# EAGLE design schematic (EAGLE 9.5.2)
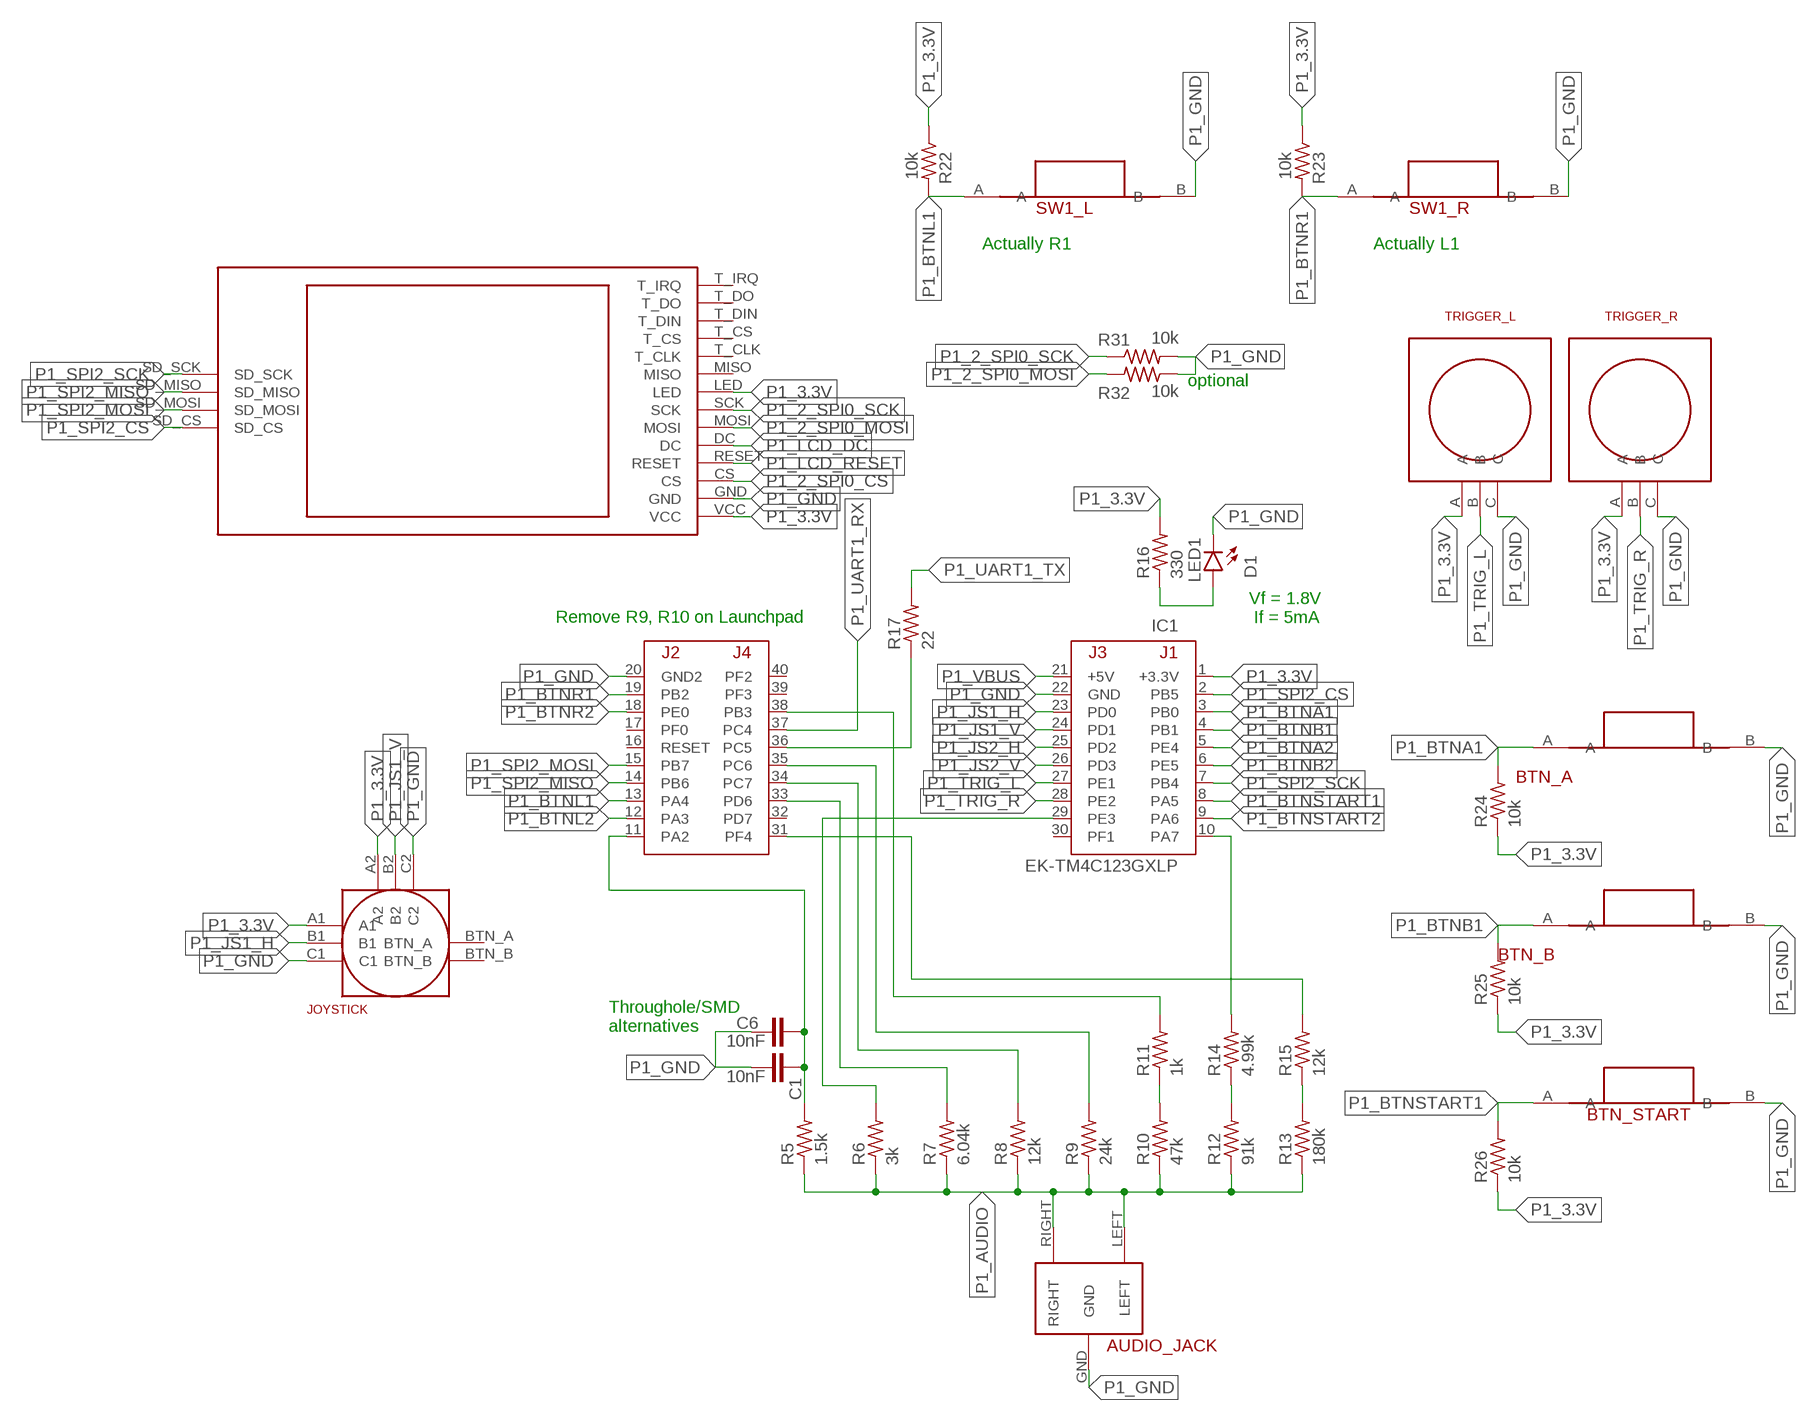
[diagram p0: schematic, sheet 1, part 1 of 2]
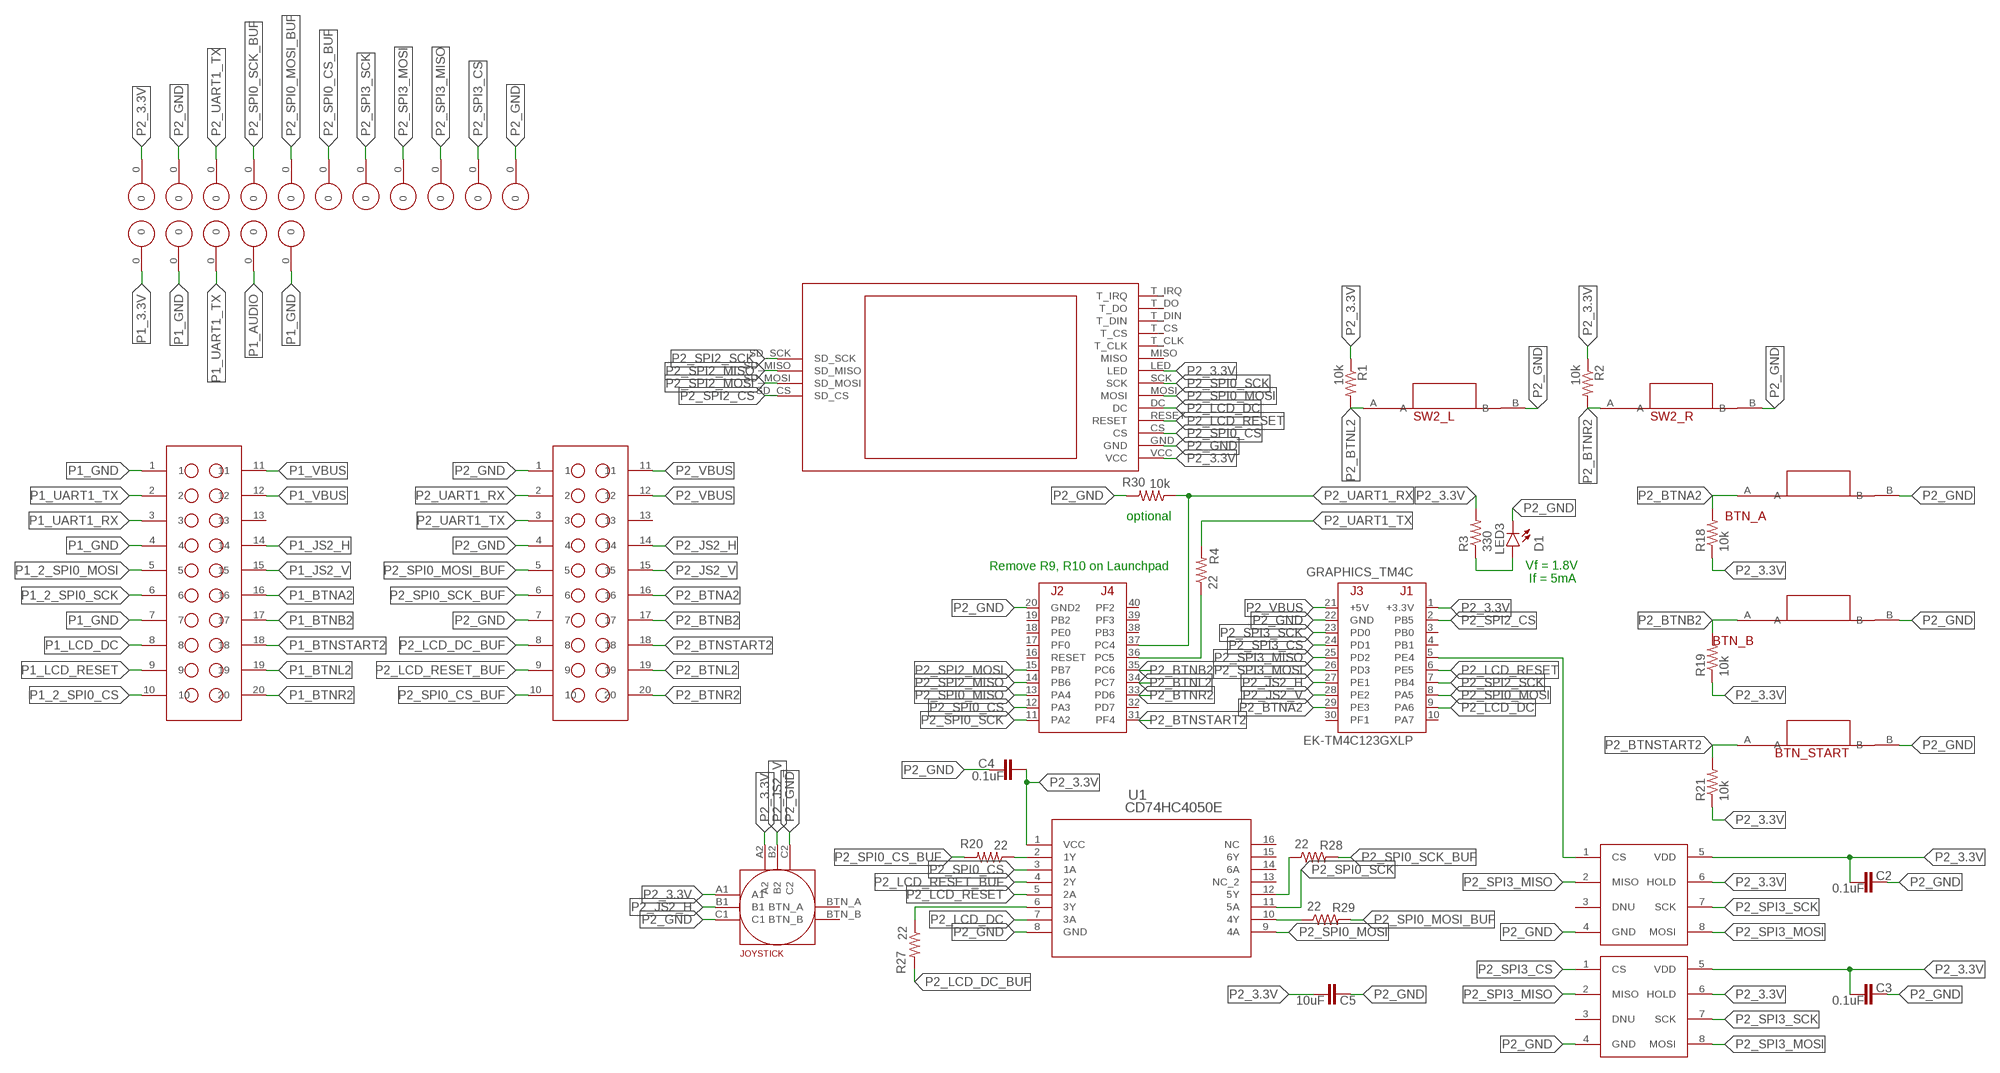
[diagram p1: schematic, sheet 1, part 2 of 2]

## Parts
C1  10nF  C-EU050-024X044  [C050-024X044]
C2  0.1uF  C-EUC0805  [C0805]
C3  0.1uF  C-EUC0805  [C0805]
C4  0.1uF  C-EUC0805  [C0805]
C5  10uF  C-EUC0805  [C0805]
C6  10nF  C-EUC0805  [C0805]
GRAPHICS_TM4C  EK-TM4C123GXLP  [TM4C123LAUNCHPAD]
IC1  EK-TM4C123GXLP  [TM4C123LAUNCHPAD]
LED1  D1  LEDCHIPLED_1206  [CHIPLED_1206]
LED3  D1  LEDCHIPLED_1206  [CHIPLED_1206]
P1_3.3V  3.3v  TESTPOINT  [TESTPOINT]
P1_AUDIO  TESTPOINT  [TESTPOINT]
P1_GND  TESTPOINT  [TESTPOINT]
P1_GND1  TESTPOINT  [TESTPOINT]
P1_LCD  ILI9341  [ILI9341]
P1_UART  TESTPOINT  [TESTPOINT]
P2_3.3V  TESTPOINT  [TESTPOINT]
P2_GND  TESTPOINT  [TESTPOINT]
P2_GND1  TESTPOINT  [TESTPOINT]
P2_LCD  ILI9341  [ILI9341]
P2_SPI0_CS_BUF  TESTPOINT  [TESTPOINT]
P2_SPI0_MOSI_BUF  TESTPOINT  [TESTPOINT]
P2_SPI0_SCK_BUF  TESTPOINT  [TESTPOINT]
P2_SPI3_CS  TESTPOINT  [TESTPOINT]
P2_SPI3_MISO  TESTPOINT  [TESTPOINT]
P2_SPI3_MOSI  TESTPOINT  [TESTPOINT]
P2_SPI3_SCK_BUF  TESTPOINT  [TESTPOINT]
P2_UART1_TX  TESTPOINT  [TESTPOINT]
R1  10k  R-US_R0805  [R0805]
R2  10k  R-US_R0805  [R0805]
R3  330  R-US_R0805  [R0805]
R4  22  R-US_R0805  [R0805]
R5  1.5k  R-US_R0805  [R0805]
R6  3k  R-US_R0805  [R0805]
R7  6.04k  R-US_R0805  [R0805]
R8  12k  R-US_R0805  [R0805]
R9  24k  R-US_R0805  [R0805]
R10  47k  R-US_R0805  [R0805]
R11  1k  R-US_R0805  [R0805]
R12  91k  R-US_R0805  [R0805]
R13  180k  R-US_R0805  [R0805]
R14  4.99k  R-US_R0805  [R0805]
R15  12k  R-US_R0805  [R0805]
R16  330  R-US_R0805  [R0805]
R17  22  R-US_R0805  [R0805]
R18  10k  R-US_R0805  [R0805]
R19  10k  R-US_R0805  [R0805]
R20  22  R-US_R0805  [R0805]
R21  10k  R-US_R0805  [R0805]
R22  10k  R-US_R0805  [R0805]
R23  10k  R-US_R0805  [R0805]
R24  10k  R-US_R0805  [R0805]
R25  10k  R-US_R0805  [R0805]
R26  10k  R-US_R0805  [R0805]
R27  22  R-US_R0805  [R0805]
R28  22  R-US_R0805  [R0805]
R29  22  R-US_R0805  [R0805]
R30  10k  R-US_R0805  [R0805]
R31  10k  R-US_R0805  [R0805]
R32  10k  R-US_R0805  [R0805]
U1  CD74HC4050E  [N16]
U$2  JOYSTICK  [JOYSTICK]
U$3  SW2_R  SW-1825968-2  [SW-1825968-2]
U$4  SW2_L  SW-1825968-2  [SW-1825968-2]
U$5  TRIGGER_L  [TRIGGER_L]
U$6  TRIGGER_R  [TRIGGER_R]
U$7  IS62WVS5128FALL-16NLI  [SOIC127P600X144-8]
U$8  IS62WVS5128FALL-16NLI  [SOIC127P600X144-8]
U$10  AUDIO_JACK  [AUDIO_JACK]
U$11  10X2_HEADER  [10X2_HEADER]
U$12  10X2_HEADER  [10X2_HEADER]
U$13  JOYSTICK  [JOYSTICK]
U$14  BTN_A  BUTTON  [BUTTON]
U$15  BTN_B  BUTTON  [BUTTON]
U$17  BTN_START  BUTTON  [BUTTON]
U$18  SW1_R  SW-1825968-2  [SW-1825968-2]
U$19  SW1_L  SW-1825968-2  [SW-1825968-2]
U$20  BTN_A  BUTTON  [BUTTON]
U$23  BTN_B  BUTTON  [BUTTON]
U$24  BTN_START  BUTTON  [BUTTON]

## Nets
N$1: IC1.29(PE3) R6.2
N$2: C1.1 C6.1 IC1.11(PA2) R5.2
N$3: GRAPHICS_TM4C.5(PE4) U$8.1(CS)
N$4: LED3.A R3.1
N$5: IC1.31(PF4) R15.2
N$8: R10.2 R11.1
N$9: R20.1 U1.2(1Y)
N$10: IC1.33(PD6) R7.2
N$11: R12.2 R14.1
N$12: LED1.A R16.1
N$13: IC1.34(PC7) R8.2
N$14: IC1.35(PC6) R9.2
N$16: IC1.36(PC5) R17.1
N$17: R13.2 R15.1
N$18: R27.1 U1.6(3Y)
N$19: IC1.38(PB3) R11.2
N$20: IC1.10(PA7) R14.2
N$21: R28.1 U1.12(5Y)
N$22: R29.1 U1.10(4Y)
N$91: GRAPHICS_TM4C.36(PC5) R4.1
P1_2_SPI0_CS: P1_LCD.CS U$11.10
P1_2_SPI0_MOSI: P1_LCD.MOSI R32.2 U$11.5
P1_2_SPI0_SCK: P1_LCD.SCK R31.1 U$11.6
P1_3.3V: IC1.1(+3.3V) P1_3.3V.0 P1_LCD.LED P1_LCD.VCC R16.2 R22.1 R23.1 R24.1 R25.1 R26.1 U$2.A1 U$2.A2 U$5.A U$6.A
P1_AUDIO: P1_AUDIO.0 R5.1 R6.1 R7.1 R8.1 R9.1 R10.1 R12.1 R13.1 U$10.LEFT U$10.RIGHT
P1_BTNA1: IC1.3(PB0) R24.2 U$20.A
P1_BTNA2: IC1.5(PE4) U$11.16
P1_BTNB1: IC1.4(PB1) R25.2 U$23.A
P1_BTNB2: IC1.6(PE5) U$11.17
P1_BTNL1: IC1.13(PA4) R22.2 U$19.A
P1_BTNL2: IC1.12(PA3) U$11.19
P1_BTNR1: IC1.19(PB2) R23.2 U$18.A
P1_BTNR2: IC1.18(PE0) U$11.20
P1_BTNSTART1: IC1.8(PA5) R26.2 U$24.A
P1_BTNSTART2: IC1.9(PA6) U$11.18
P1_GND: C1.2 C6.2 IC1.20(GND2) IC1.22(GND) LED1.C P1_GND1.0 P1_GND.0 P1_LCD.GND R31.2 R32.1 U$2.C1 U$2.C2 U$5.C U$6.C U$10.GND U$11.1 U$11.4 U$11.7 U$18.B U$19.B U$20.B U$23.B U$24.B
P1_JS1_H: IC1.23(PD0) U$2.B1
P1_JS1_V: IC1.24(PD1) U$2.B2
P1_JS2_H: IC1.25(PD2) U$11.14
P1_JS2_V: IC1.26(PD3) U$11.15
P1_LCD_DC: P1_LCD.DC U$11.8
P1_LCD_RESET: P1_LCD.RESET U$11.9
P1_SPI2_CS: IC1.2(PB5) P1_LCD.SD_CS
P1_SPI2_MISO: IC1.14(PB6) P1_LCD.SD_MISO
P1_SPI2_MOSI: IC1.15(PB7) P1_LCD.SD_MOSI
P1_SPI2_SCK: IC1.7(PB4) P1_LCD.SD_SCK
P1_TRIG_L: IC1.27(PE1) U$5.B
P1_TRIG_R: IC1.28(PE2) U$6.B
P1_UART1_RX: IC1.37(PC4) U$11.3
P1_UART1_TX: P1_UART.0 R17.2 U$11.2
P1_VBUS: IC1.21(+5V) U$11.11 U$11.12
P2_3.3V: C2.2 C3.2 C4.1 C5.2 GRAPHICS_TM4C.1(+3.3V) P2_3.3V.0 P2_LCD.LED P2_LCD.VCC R1.1 R2.1 R3.2 R18.1 R19.1 R21.1 U1.1(VCC) U$7.5(VDD) U$7.6(HOLD) U$8.5(VDD) U$8.6(HOLD) U$13.A1 U$13.A2
P2_BTNA2: GRAPHICS_TM4C.29(PE3) R18.2 U$12.16 U$14.A
P2_BTNB2: GRAPHICS_TM4C.35(PC6) R19.2 U$12.17 U$15.A
P2_BTNL2: GRAPHICS_TM4C.34(PC7) R1.2 U$4.A U$12.19
P2_BTNR2: GRAPHICS_TM4C.33(PD6) R2.2 U$3.A U$12.20
P2_BTNSTART2: GRAPHICS_TM4C.31(PF4) R21.2 U$12.18 U$17.A
P2_GND: C2.1 C3.1 C4.2 C5.1 GRAPHICS_TM4C.20(GND2) GRAPHICS_TM4C.22(GND) LED3.C P2_GND1.0 P2_GND.0 P2_LCD.GND R30.2 U1.8(GND) U$3.B U$4.B U$7.4(GND) U$8.4(GND) U$12.1 U$12.4 U$12.7 U$13.C1 U$13.C2 U$14.B U$15.B U$17.B
P2_JS2_H: GRAPHICS_TM4C.27(PE1) U$12.14 U$13.B1
P2_JS2_V: GRAPHICS_TM4C.28(PE2) U$12.15 U$13.B2
P2_LCD_DC: GRAPHICS_TM4C.9(PA6) P2_LCD.DC U1.7(3A)
P2_LCD_DC_BUF: R27.2 U$12.8
P2_LCD_RESET: GRAPHICS_TM4C.6(PE5) P2_LCD.RESET U1.5(2A)
P2_LCD_RESET_BUF: U1.4(2Y) U$12.9
P2_SPI0_CS: GRAPHICS_TM4C.12(PA3) P2_LCD.CS U1.3(1A)
P2_SPI0_CS_BUF: P2_SPI0_CS_BUF.0 R20.2 U$12.10
P2_SPI0_MISO: GRAPHICS_TM4C.13(PA4)
P2_SPI0_MOSI: GRAPHICS_TM4C.8(PA5) P2_LCD.MOSI U1.9(4A)
P2_SPI0_MOSI_BUF: P2_SPI0_MOSI_BUF.0 R29.2 U$12.5
P2_SPI0_SCK: GRAPHICS_TM4C.11(PA2) P2_LCD.SCK U1.11(5A)
P2_SPI0_SCK_BUF: P2_SPI0_SCK_BUF.0 R28.2 U$12.6
P2_SPI2_CS: GRAPHICS_TM4C.2(PB5) P2_LCD.SD_CS
P2_SPI2_MISO: GRAPHICS_TM4C.14(PB6) P2_LCD.SD_MISO
P2_SPI2_MOSI: GRAPHICS_TM4C.15(PB7) P2_LCD.SD_MOSI
P2_SPI2_SCK: GRAPHICS_TM4C.7(PB4) P2_LCD.SD_SCK
P2_SPI3_CS: GRAPHICS_TM4C.24(PD1) P2_SPI3_CS.0 U$7.1(CS)
P2_SPI3_MISO: GRAPHICS_TM4C.25(PD2) P2_SPI3_MISO.0 U$7.2(MISO) U$8.2(MISO)
P2_SPI3_MOSI: GRAPHICS_TM4C.26(PD3) P2_SPI3_MOSI.0 U$7.8(MOSI) U$8.8(MOSI)
P2_SPI3_SCK: GRAPHICS_TM4C.23(PD0) P2_SPI3_SCK_BUF.0 U$7.7(SCK) U$8.7(SCK)
P2_UART1_RX: GRAPHICS_TM4C.37(PC4) R30.1 U$12.2
P2_UART1_TX: P2_UART1_TX.0 R4.2 U$12.3
P2_VBUS: GRAPHICS_TM4C.21(+5V) U$12.11 U$12.12
Unconnected: GRAPHICS_TM4C.3(PB0) GRAPHICS_TM4C.4(PB1) GRAPHICS_TM4C.10(PA7) GRAPHICS_TM4C.16(RESET) GRAPHICS_TM4C.17(PF0) GRAPHICS_TM4C.18(PE0) GRAPHICS_TM4C.19(PB2) GRAPHICS_TM4C.30(PF1) GRAPHICS_TM4C.32(PD7) GRAPHICS_TM4C.38(PB3) GRAPHICS_TM4C.39(PF3) GRAPHICS_TM4C.40(PF2) IC1.16(RESET) IC1.17(PF0) IC1.30(PF1) IC1.32(PD7) IC1.39(PF3) IC1.40(PF2) P1_LCD.MISO P1_LCD.T_CLK P1_LCD.T_CS P1_LCD.T_DIN P1_LCD.T_DO P1_LCD.T_IRQ P2_LCD.MISO P2_LCD.T_CLK P2_LCD.T_CS P2_LCD.T_DIN P2_LCD.T_DO P2_LCD.T_IRQ U1.13(NC_2) U1.14(6A) U1.15(6Y) U1.16(NC) U$2.BTN_A U$2.BTN_B U$7.3(DNU) U$8.3(DNU) U$11.13 U$12.13 U$13.BTN_A U$13.BTN_B

## Notes on the sheet
- Actually R1 | Actually L1
- optional
- optional
- Remove R9, R10 on Launchpad
- Vf = 1.8V
   If = 5mA
- Remove R9, R10 on Launchpad
- Vf = 1.8V
   If = 5mA
- Throughole/SMD
  alternatives

## Library data of the parts
C1-C6 = rcl:C-EU: CAPACITOR, European symbol; SPICEPREFIX: C
GRAPHICS_TM4C IC1 = EK-TM4C123GXL:EK-TM4C123GXL: Texas Instruments TM4C123 LaunchPad EK-TM4C123GXL www.ti.com/tool/ek-tm4c123gxl; AVAILABILITY: Unavailable; DESCRIPTION: TM4C123G LaunchPad™ Tiva™ C ARM® Cortex®-M4F MCU 32-Bit Embedded Evaluation Board; MF: Texas Instruments; MP: EK-TM4C123GXL; PACKAGE: None; PRICE: None
LED1 LED3 = led:LED: LED OSRAM: - CHIPLED LG R971, LG N971, LY N971, LG Q971, LY Q971, LO R971, LY R971 LH N974, LH R974 LS Q976, LO Q976, LY Q976 LO Q996 - Hyper CHIPLED LW Q18S LB Q993, LB Q99A, LB R99A - SideLED LS A670, LO A670, LY A670, LG A670, LP A670 LB A673, LV A673, LT A673, LW A673 LH A674 LY A675 LS A676, LA A676, LO A676, LY A676, LW A676 LS A679, LY A679, LG A679 - Hyper Micro SIDELED® LS Y876, LA Y876, LO Y876, LY Y876 LT Y87S - SmartLED LW L88C, LW L88S LB L89C, LB L89S, LG L890 LS L89K, LO L89K, LY L89K LS L896, LA L896, LO L896, LY L896 - TOPLED LS T670, LO T670, LY T670, LG T670, LP T670 LSG T670, LSP T670, LSY T670, LOP T670, LYG T670 LG T671, LOG T671, LSG T671 LB T673, LV T673, LT T673, LW T673 LH T674 LS T676, LA T676, LO T676, LY T676, LB T676, LH T676, LSB T676, LW T676 LB T67C, LV T67C, LT T67C, LS T67K, LO T67K, LY T67K, LW E67C LS E67B, LA E67B, LO E67B, LY E67B, LB E67C, LV E67C, LT E67C LW T67C LS T679, LY T679, LG T679 LS T770, LO T770, LY T770, LG T770, LP T770 LB T773, LV T773, LT T773, LW T773 LH T774 LS E675, LA E675, LY E675, LS T675 LS T776, LA T776, LO T776, LY T776, LB T776 LHGB T686 LT T68C, LB T68C - Hyper Mini TOPLED® LB M676 - Mini TOPLED Santana® LG M470 LS M47K, LO M47K, LY M47K Source: http://www.osram.convergy.de LUXEON: - LUMILED® LXK2-PW12-R00, LXK2-PW12-S00, LXK2-PW14-U00, LXK2-PW14-V00 LXK2-PM12-R00, LXK2-PM12-S00, LXK2-PM14-U00 LXK2-PE12-Q00, LXK2-PE12-R00, LXK2-PE12-S00, LXK2-PE14-T00, LXK2-PE14-U00 LXK2-PB12-K00, LXK2-PB12-L00, LXK2-PB12-M00, LXK2-PB14-N00, LXK2-PB14-P00, LXK2-PB14-Q00 LXK2-PR12-L00, LXK2-PR12-M00, LXK2-PR14-Q00, LXK2-PR14-R00 LXK2-PD12-Q00, LXK2-PD12-R00, LXK2-PD12-S00 LXK2-PH12-R00, LXK2-PH12-S00 LXK2-PL12-P00, LXK2-PL12-Q00, LXK2-PL12-R00 Source: www.luxeon.com KINGBRIGHT: KA-3528ASYC Source: www.kingbright.com
P1_3.3V P1_AUDIO P1_GND P1_GND1 P1_UART P2_3.3V P2_GND P2_GND1 P2_SPI0_CS_BUF P2_SPI0_MOSI_BUF P2_SPI0_SCK_BUF P2_SPI3_CS P2_SPI3_MISO P2_SPI3_MOSI P2_SPI3_SCK_BUF P2_UART1_TX = 319H Final Project:TESTPOINT
P1_LCD P2_LCD = 319H Final Project:ILI9341
R1-R32 = rcl:R-US_: RESISTOR, American symbol; SPICEPREFIX: R
U1 = 319H Final Project:CD74HC4050E; BUILT_BY: EMA_UL_Team; MANUFACTURER_PART_NUMBER: CD74HC4050E; VENDOR: Texas Instruments
U$2 U$13 = 319H Final Project:JOYSTICK
U$3 U$4 U$18 U$19 = 319H Final Project:SW-1825968-2
U$5 = 319H Final Project:TRIGGER_L
U$6 = 319H Final Project:TRIGGER_R
U$7 U$8 = 319H Final Project:IS62WVS5128FALL-16NLI
U$10 = 319H Final Project:AUDIO_JACK
U$11 U$12 = 319H Final Project:10X2_HEADER
U$14 U$15 U$17 U$20 U$23 U$24 = 319H Final Project:BUTTON

## Board
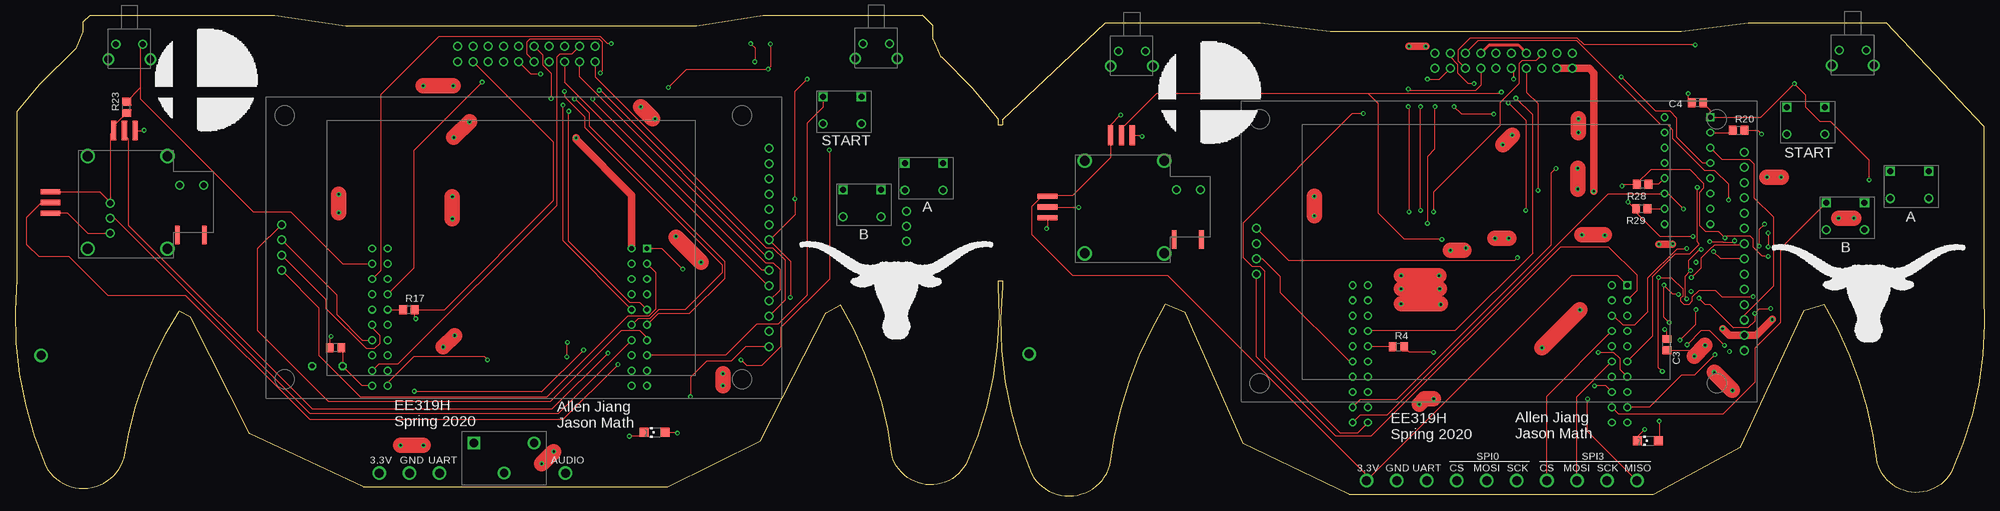
[diagram p2: board, top side]
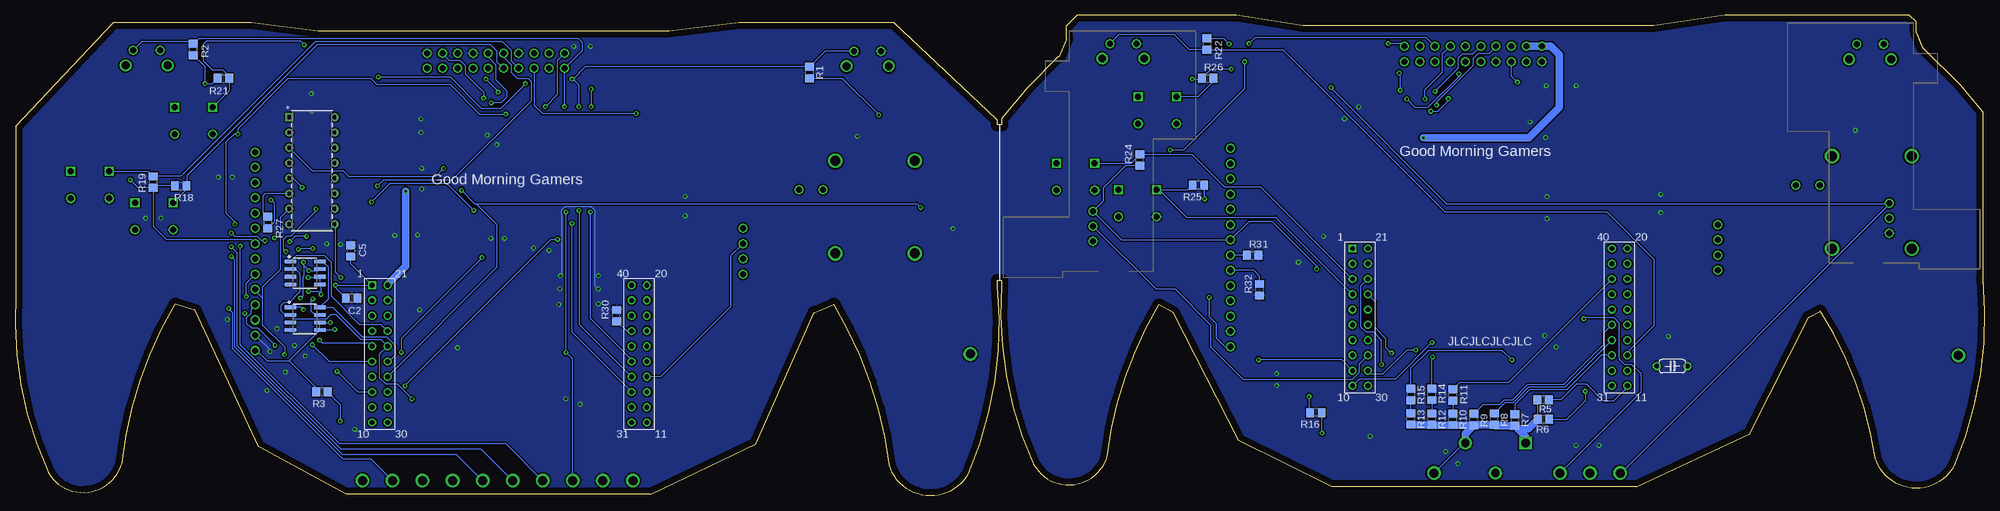
[diagram p3: board, bottom side, seen from below]

Size 327.85 x 80.03 mm. Coordinates in mm from the lower left corner, seen from the top.
Outline: 152.82,78.25 151.04,80.03 124.5,80.03 113.45,78.25 55.03,78.25 43.22,80.03 12.48,80.03 11.34,78.89 11.34,77.24 10.2,74.44 10.07,74.44 4.1,68.47 0.29,63.9 0.29,36.09 arc29 5.12,4.97 arc135 18.2,6.37 arc-24 27.34,30.75 29.25,29.74 39.03,10.31 57.95,1.54 108.62,1.54 124.12,9.16 135.04,30.5 137.45,31.77 arc-24 145.96,6.75 arc135 158.28,5.23 arc29 163.61,34.95 163.61,35.83 164.37,35.83 164.37,34.82 arc29 169.2,3.7 arc135 182.28,5.1 arc-24 191.55,31.9 194.85,30.5 204.51,8.66 222.03,0.27 272.71,0.27 287.31,8.15 297.85,30.88 301.15,31.9 arc-24 310.04,5.48 arc135 322.36,3.96 arc29 327.7,33.68 327.7,61.49 311.53,78.76 288.58,78.76 277.4,77.36 218.98,77.36 207.3,78.76 181.53,78.76 164.37,62.63 164.37,61.74 163.61,61.74 163.61,62.76 159.29,67.97 154.21,73.05 154.09,73.05 152.82,75.97 152.82,78.25
Copper layers (1*16): Top 0.035mm / dielectric 1.5mm / Bottom 0.035mm
Design rules "default *": minimum track width 6mil, minimum drill 0.35mm, track to track 10mil, track to pad 10mil, pad to pad 10mil, via to via 10mil, smd to smd 10mil, copper to edge 40mil, drill to drill 6mil, minimum pad ring 10mil, minimum via ring 8mil, stop-mask expansion 4mil, vias tented up to drill 0mil, thermal gap 10mil

### Footprints (pad centres in the part's own frame; a part is rotated, then mirrored left to right if it is on the bottom)
C050-024X044 = drill 0.813 octagon: 1 -2.54,0; 2 2.54,0
C0805 = smd 1.3 x 1.5: 1 -0.95,0; 2 0.95,0
TM4C123LAUNCHPAD = drill 0.8 square: 1 -22.86,12.7 | drill 0.8: 2 -22.86,10.16; 3 -22.86,7.62; 4 -22.86,5.08; 5 -22.86,2.54; 6 -22.86,0; 7 -22.86,-2.54; 8 -22.86,-5.08; 9 -22.86,-7.62; 10 -22.86,-10.16; 11 22.86,-10.16; 12 22.86,-7.62; 13 22.86,-5.08; 14 22.86,-2.54; 15 22.86,0; 16 22.86,2.54; 17 22.86,5.08; 18 22.86,7.62; 19 22.86,10.16; 20 22.86,12.7; 21 -20.32,12.7; 22 -20.32,10.16; 23 -20.32,7.62; 24 -20.32,5.08; 25 -20.32,2.54; 26 -20.32,0; 27 -20.32,-2.54; 28 -20.32,-5.08; 29 -20.32,-7.62; 30 -20.32,-10.16; 31 20.32,-10.16; 32 20.32,-7.62; 33 20.32,-5.08; 34 20.32,-2.54; 35 20.32,0; 36 20.32,2.54; 37 20.32,5.08; 38 20.32,7.62; 39 20.32,10.16; 40 20.32,12.7
CHIPLED_1206 = smd 1.5 x 1.5: A 0,-1.75; C 0,1.75
TESTPOINT = drill 1.5: 0 0,0
ILI9341 = drill 1: CS 83.713,13.635; DC 83.713,18.715; GND 83.713,11.095; LED 83.713,26.335; MISO 83.713,28.875; MOSI 83.713,21.255; RESET 83.713,16.175; SCK 83.713,23.795; SD_CS 2.538,21.261; SD_MISO 2.538,26.341; SD_MOSI 2.538,23.801; SD_SCK 2.538,28.881; T_CLK 83.713,31.415; T_CS 83.713,33.955; T_DIN 83.713,36.495; T_DO 83.713,39.035; T_IRQ 83.713,41.575; VCC 83.713,8.555
R0805 = smd 1.3 x 1.5: 1 -0.95,0; 2 0.95,0
N16 = drill 0.787 pad 1.295 square: 1 -7.62,17.78 | drill 0.787 pad 1.295: 2 -7.62,15.24; 3 -7.62,12.7; 4 -7.62,10.16; 5 -7.62,7.62; 6 -7.62,5.08; 7 -7.62,2.54; 8 -7.62,0; 9 0,0; 10 0,2.54; 11 0,5.08; 12 0,7.62; 13 0,10.16; 14 0,12.7; 15 0,15.24; 16 0,17.78
JOYSTICK = smd 3.3 x 0.86: A1 -13.094,1.72; B1 -13.094,-0.08; C1 -13.094,-1.88 | smd 0.86 x 3.3: A2 -2.583,11.89; B2 -0.783,11.89; C2 1.017,11.89 | smd 0.8 x 3.1: BTN_A 8.031,-5.469; BTN_B 12.539,-5.469 | drill 1.6: P$1 6.35,7.62; P$2 -6.9,7.62; P$3 6.35,-7.78; P$4 -6.9,-7.78 | drill 1: P$11 8.412,2.77; P$12 12.412,2.77
SW-1825968-2 = drill 1.295: 3 -3.2,2.54; 4 3.81,2.54 | drill 1: A -1.93,0.051; B 2.54,0.051
TRIGGER_L = drill 1: A 1.27,-7.7; B 1.27,-10.2; C 1.27,-12.7
TRIGGER_R = drill 1: A -3.81,-7.7; B -3.81,-10.2; C -3.81,-12.7
SOIC127P600X144-8 = smd 1.901 x 0.599: 1 -2.455,1.905; 2 -2.455,0.635; 3 -2.455,-0.635; 4 -2.455,-1.905; 5 2.455,-1.905; 6 2.455,-0.635; 7 2.455,0.635; 8 2.455,1.905
AUDIO_JACK = drill 1.4: GND 0,-2.54; LEFT 5,2.46 | drill 1.4 square: RIGHT -5,2.46
10X2_HEADER = drill 1: 1 -1.27,11.557; 2 -1.27,9.017; 3 -1.27,6.477; 4 -1.27,3.937; 5 -1.27,1.397; 6 -1.27,-1.143; 7 -1.27,-3.683; 8 -1.27,-6.223; 9 -1.27,-8.763; 10 -1.27,-11.303; 11 1.27,11.557; 12 1.27,9.017; 13 1.27,6.477; 14 1.27,3.937; 15 1.27,1.397; 16 1.27,-1.143; 17 1.27,-3.683; 18 1.27,-6.223; 19 1.27,-8.763; 20 1.27,-11.303
BUTTON = drill 1 square: A -3.81,2.54; A@1 2.54,2.54 | drill 1: B -3.81,-1.96; B@1 2.54,-1.96

### Placement (x,y rotation side)
C1  51.98,21.61 0 bottom
C2  271.82,32.91 180 bottom
C3  274.99,25.17 90 top
C4  280.07,65.43 180 top
C5  271.94,40.79 270 bottom
C6  53.38,24.66 180 top
GRAPHICS_TM4C  245.53,22.37 0 bottom
IC1  82.33,28.47 0 bottom
LED1  106.46,10.56 90 top
LED3  271.82,9.16 90 top
P1_3.3V  60.65,3.8 90 top
P1_AUDIO  91.65,3.8 90 top
P1_GND  65.65,3.8 90 top
P1_GND1  4.35,23.39 0 top
P1_LCD  41.82,16.28 0 top
P1_UART  70.65,3.8 90 top
P2_3.3V  225,2.55 90 top
P2_GND  230,2.55 90 top
P2_GND1  168.82,23.64 0 top
P2_LCD  204.13,15.64 0 top
P2_SPI0_CS_BUF  240,2.55 0 top
P2_SPI0_MOSI_BUF  245,2.55 0 top
P2_SPI0_SCK_BUF  250,2.55 0 top
P2_SPI3_CS  255,2.55 0 top
P2_SPI3_MISO  270,2.55 0 top
P2_SPI3_MOSI  260,2.55 0 top
P2_SPI3_SCK_BUF  265,2.55 0 top
P2_UART1_TX  235,2.55 0 top
R1  195.6,70.46 90 bottom
R2  298.17,74.3 90 bottom
R3  276.77,17.29 180 bottom
R4  230.29,24.79 0 top
R5  73.46,16.03 0 bottom
R6  73.42,12.78 0 bottom
R7  78.15,12.63 90 bottom
R8  81.63,12.78 90 bottom
R9  84.99,12.7 90 bottom
R10  88.5,12.74 90 bottom
R11  88.48,16.8 90 bottom
R12  91.99,12.77 90 bottom
R13  95.48,12.82 90 bottom
R14  91.99,16.9 90 bottom
R15  95.47,16.88 90 bottom
R16  111.29,13.86 180 bottom
R17  65.57,31.01 0 top
R18  300.26,51.58 0 bottom
R19  304.84,52.22 90 bottom
R20  286.93,60.85 0 top
R21  293.15,69.49 0 bottom
R22  129.45,75.2 270 bottom
R23  18.58,64.66 90 top
R24  140.63,55.9 90 bottom
R25  130.85,51.71 180 bottom
R26  129.32,69.49 0 bottom
R27  285.79,45.49 270 bottom
R28  270.93,51.84 180 top
R29  270.8,47.77 180 top
R30  227.75,29.99 90 bottom
R31  121.83,40.03 0 bottom
R32  120.69,34.31 90 bottom
U1  274.61,45.23 0 bottom
U$2  19.01,48.92 0 top
U$3  306.23,74.19 180 top
U$4  186.22,74.06 180 top
U$5  17.09,56.4 0 bottom
U$6  144.57,55.06 0 bottom
U$7  279.56,37.1 0 bottom
U$8  279.56,29.48 0 bottom
U$10  81.42,6.32 0 top
U$11  85.25,73.55 90 top
U$12  247.69,72.41 270 top
U$13  184.95,48.15 0 top
U$14  305.34,46.25 0 top
U$15  316.01,51.46 0 top
U$17  298.74,62.12 0 top
U$18  19.34,75.2 180 top
U$19  143.67,75.33 180 top
U$20  151.93,52.85 0 top
U$23  141.64,48.41 0 top
U$24  138.34,63.9 0 top

### Tracks (layer width: path | path; a pad name or v marks a point on that pad's centre or on a via)
N$1  (via drill 0.35)
  Top 0.152: v94.65,24.28 87.67,17.29 66.58,17.29 v66.46,17.42
  Bottom 0.152: R6.2 69.55,12.78 66.46,15.87 v66.46,17.42 | v94.65,24.28 96.18,24.28 100.24,20.21 102.02,20.21 IC1.29
N$2
  Top 0.152: IC1.11 57.82,18.31 C1.1 54.52,24.47 C6.1
  Bottom 0.152: IC1.11 59.47,18.05 61.76,15.77 63.41,15.77 66.2,18.56 67.98,18.56 70.51,16.03 R5.2
N$3  (via drill 0.35)
  Top 0.152: v277.15,25.93 279.82,28.6 v279.82,31.01
  Bottom 0.152: GRAPHICS_TM4C.5 268.9,25.42 276.64,25.42 v277.15,25.93 | v279.82,31.01 280.2,31.39 U$8.1
N$4  (via drill 0.35)
  Top 0.152: v273.72,12.45 273.72,9.32 LED3.A
  Bottom 0.152: R3.1 273.72,15.19 v273.72,12.45
N$5  (via drill 0.35)
  Top 0.152: v78.65,22.63 78.14,23.13 66.33,23.13 62.01,18.82 IC1.31
  Bottom 0.152: R15.2 95.47,21.3 92.49,24.28 80.3,24.28 v78.65,22.63
N$8
  Bottom 0.152: R11.1 88.48,13.7 R10.2
N$9
  Top 0.152: U1.2 285.6,60.47 R20.1
N$10
  Bottom 0.152: IC1.33 63.79,23.39 69.51,17.67 75.73,17.67 78.15,15.25 R7.2
N$11
  Bottom 0.152: R14.1 R12.2
N$12  (via drill 0.35)
  Top 0.152: LED1.A 110.15,10.56 v110.27,10.43
  Bottom 0.152: v110.27,10.43 110.27,13.8 R16.1
N$13
  Bottom 0.152: R8.2 79.84,15.51 78.46,15.51 75.9,18.08 69.86,18.08 IC1.34
N$14
  Bottom 0.152: IC1.35 63.41,27.07 63.41,25.17 70.09,18.49 76.07,18.49 78.63,15.92 80.01,15.92 80.79,15.13 83.5,15.13 R9.2
N$16
  Top 0.152: IC1.36 R17.1
N$17
  Bottom 0.152: R13.2 95.48,15.91 R15.1
N$18
  Bottom 0.152: U1.6 286.19,50.31 286.65,49.84 286.65,47.3 R27.1
N$19
  Bottom 0.152: IC1.38 79.21,18.89 87.34,18.89 R11.2
N$20  (via drill 0.35)
  Top 0.152: v91.98,25.55 91.86,25.42 v91.86,23.13
  Bottom 0.152: IC1.10 104.05,19.45 98.08,19.45 v91.98,25.55 | R14.2 91.99,23 v91.86,23.13
N$21
  Top 0.152: U1.12 273.59,51.84 R28.1
N$22
  Top 0.152: R29.1 U1.10
N$91
  Top 0.152: R4.1 225.33,24.79 GRAPHICS_TM4C.36
P1_2_SPI0_CS
  Top 0.152: U$11.10 96.56,69.74 125,41.3 126.15,41.3 128.18,39.26 128.18,32.56 P1_LCD.CS
P1_2_SPI0_MOSI  (via drill 0.35)
  Top 0.152: P1_LCD.MOSI 124.39,37.53 96.18,65.75 v96.18,66.06 | v87.5,70.21 85.93,70.21 U$11.5
  Bottom 0.152: v96.18,66.06 94.78,64.66 92.62,64.66 87.29,70 v87.5,70.21 | R32.2 120.69,36.6 121.62,37.53 P1_LCD.MOSI
P1_2_SPI0_SCK  (via drill 0.35)
  Top 0.152: v97.25,67.51 97.46,67.51 124.9,40.07 P1_LCD.SCK | v97.45,70.38 97.83,70.76 97.83,75.46 97.29,76 85.66,76 85.13,75.46 85.13,73.55 U$11.6
  Bottom 0.152: R31.1 122.83,40.07 P1_LCD.SCK | v97.25,67.51 97.25,70.18 v97.45,70.38
P1_3.3V  (via drill 0.35)
  Top 0.152: U$2.A1 14.06,50.64 15.91,48.79 U$5.A 15.82,60.2 U$2.A2 16.93,62.07 R23.1 | v108.75,67.97 111.8,71.01 v125.39,71.01 125.77,71.39 v125.77,75.2 | v111.16,37.74 107.73,41.17 IC1.1 | P1_LCD.LED 125.61,42.53 | 125.61,42.53 129.07,39.08 v129.07,33.04 | P1_LCD.VCC 121.62,24.83 119.16,22.37 115.1,22.37 112.43,19.71 v112.43,16.53 | 125.61,42.53 129.83,46.76 v129.83,49.42 129.83,67.33 v131.86,69.36
  Bottom 0.152: U$5.A 15.91,48.7 15.91,48.58 | 15.91,48.58 89.49,48.58 108.75,67.84 v108.75,67.97 | P1_3.3V.0 60.53,3.93 60.4,3.93 15.91,48.42 15.91,48.58 | v111.16,37.74 111.16,38.25 118.65,45.74 122.4,45.74 P1_LCD.LED 143.63,42.61 U$6.A 148.38,47.39 146.72,49.05 146.72,51.2 142.97,54.95 R24.1 | v129.07,33.04 129.07,29.87 127.93,28.72 127.93,26.31 126.45,24.83 P1_LCD.VCC | v112.43,16.53 112.43,14.06 R16.2 | R25.1 129.9,49.49 v129.83,49.42 | v125.39,71.01 128.75,71.01 R26.1 130.4,69.36 v131.86,69.36 | R22.1 126.72,76.15 v125.77,75.2
P1_AUDIO
  Bottom 0.152: R5.1 74.41,12.81 R6.1 | 77.67,11.2 R7.1 | 81.48,11.68 R8.1 | 84.91,11.83 R9.1 | 88.46,11.75 R10.1 | 92.54,11.79 92.62,11.7 92.1,11.7 R12.1 | 95.43,11.82 R13.1 | U$10.LEFT 86.67,8.78 P1_AUDIO.0
  Bottom 1.27: R6.1 75.95,11.2 77.67,11.2 76.42,9.95 U$10.RIGHT | R7.1 81.48,11.68 | R8.1 84.91,11.83 | U$10.LEFT 86.42,10.32 R9.1 88.46,11.75 | R10.1 92.54,11.79 | R12.1 95.43,11.82
P1_BTNA1
  Bottom 0.152: U$20.A 142.08,55.39 R24.2 131.92,56.85 126.53,51.46 120.56,51.46 IC1.3
P1_BTNA2  (via drill 0.35)
  Top 0.152: IC1.5 104.05,32.15 102.4,32.15 92.17,42.38 v92.17,64.01 | U$11.16 87.79,73.43 87.79,71.78 89.24,70.32 v89.24,66.12
  Bottom 0.152: v92.17,64.01 90.97,64.01 89.24,65.73 v89.24,66.12
P1_BTNB1
  Bottom 0.152: R25.2 132.56,50.95 U$23.A 137.45,50.95 132.88,46.38 118.02,46.38 IC1.4
P1_BTNB2  (via drill 0.35)
  Top 0.152: IC1.6 105.9,29.18 105.91,29.18 107.1,30.37 112.3,30.37 118.17,36.24 118.17,38.98 95.67,61.49 95.67,63.65 93.25,66.06 v93.13,66.06
  Bottom 0.152: v93.13,66.06 93.13,67.58 90.21,70.51 90.21,73.55 U$11.17
P1_BTNL1
  Bottom 0.152: U$19.A 144.16,76.73 134.84,76.73 132.37,74.25 R22.2 116.82,74.25 89.83,47.26 62.9,47.26 55.03,39.39 55.03,28.34 59.47,23.9 IC1.13
P1_BTNL2
  Top 0.152: IC1.12 60.62,21.99 63.79,21.99 90.21,48.41 90.21,73.05 90.71,73.55 92.75,73.55 U$11.19
P1_BTNR1
  Top 0.152: 20.86,67.89 20.86,74.82 21.19,75.15 U$18.A | 20.86,67.89 20.86,66.07 39.66,47.26 45.88,47.26 54.52,38.63 IC1.19 | R23.2 20.86,67.89
P1_BTNR2  (via drill 0.35)
  Top 0.152: v99.25,75.25 98.61,75.25 97.46,76.4 70.51,76.4 60.85,66.75 60.85,37.47 IC1.18
  Bottom 0.152: U$11.20 96.99,75.25 v99.25,75.25
P1_BTNSTART1
  Top 0.152: U$24.A 134.53,64.66 131.86,62 131.86,33.42 127.04,28.6 123.48,28.6 118.27,23.39 IC1.8
  Bottom 0.152: R26.2 128.37,68.98 130.91,66.44 U$24.A
P1_BTNSTART2  (via drill 0.35)
  Top 0.152: v122.45,75.25 123.15,74.55 v123.15,72.25 | v135.55,57.56 135.55,36.05 127.45,27.95 127.45,24.85 124.25,21.65 121.85,21.65 v120.85,22.65
  Bottom 0.152: U$11.18 92.87,76.22 121.49,76.22 v122.45,75.25 | v123.15,72.25 123.15,67.75 133.35,57.56 v135.55,57.56 | IC1.9 107,22.65 v120.85,22.65
P1_GND  (via drill 0.35)
  Top 0.152: U$2.C1 8.8,47.04 12.13,43.7 U$5.C | 110.02,43.07 v110.02,43.2 | LED1.C 104.08,9.93 v102.27,9.93 | C6.2 52.43,26.38 v52.61,26.56 | U$2.C2 21.45,60.81 v21.5,60.85 | v106.55,62.75 106.15,62.75
  Top 2.54: v64.17,8.4 v67.98,8.4 | v114.21,38.88 110.02,43.07 | v72.81,49.8 v72.81,46.12 | v87.67,5.35 v89.7,7.39 | v53.88,50.19 v53.88,47.14 | v73.19,26.69 v71.28,24.79 | v117.85,20.35 v117.85,18.35 | v72.95,68.25 v67.95,68.25 | v73.05,59.65 v75.65,62.25 | 106.15,62.75 v104.15,64.75
  pour Bottom: 11.21,84.09 -15.46,57.42 -15.46,-5.06 15.91,-5.06 28.23,7.26 39.15,-3.66 121.07,-3.66 136.31,11.58 136.56,11.58 151.42,-3.28 157.77,-3.28 163.99,2.94 163.99,68.09 147.99,84.09
P1_JS1_H  (via drill 0.35)
  Top 0.152: v100.37,21.86 91.22,12.72 49.06,12.72 28.36,33.42 15.4,33.42 8.96,39.86 3.94,39.86 1.98,41.82 1.98,46.37 4.45,48.84 U$2.B1
  Bottom 0.152: v100.37,21.86 100.37,25.93 101.64,27.2 102.91,27.2 103.8,28.09 103.8,34.95 IC1.23
P1_JS1_V  (via drill 0.35)
  Top 0.152: v98.72,23.77 89.44,14.5 49.44,14.5 18.96,44.98 18.96,59.33 17.94,60.35 17.94,60.52 U$2.B2
  Bottom 0.152: v98.72,23.77 99.6,24.66 99.6,26.18 101.38,27.96 101.38,32.28 IC1.24
P1_JS2_H  (via drill 0.35)
  Top 0.152: IC1.25 91.22,42.44 v91.22,65.04
  Bottom 0.152: v91.22,65.04 91.22,65.49 85.06,71.65 85.06,72.86 84.24,73.68 82.46,73.68 U$11.14
P1_JS2_V  (via drill 0.35)
  Top 0.152: IC1.26 103.77,29.59 105.74,29.59 107.22,31.07 111.61,31.07 117.77,37.23 117.77,38.37 94.91,61.23 94.91,63.01 91.48,66.44 v91.48,67.33
  Bottom 0.152: v91.48,67.33 87.54,71.27 87.54,72.92 86.9,73.55 85.13,73.55 U$11.15
P1_LCD_DC
  Top 0.152: P1_LCD.DC 125.34,34.99 91.48,68.85 U$11.8
P1_LCD_RESET
  Top 0.152: P1_LCD.RESET 127.42,34.34 127.42,37.61 126.27,38.76 125,38.76 94.02,69.74 U$11.9
P1_SPI2_CS
  Top 0.152: P1_LCD.SD_CS 50.58,31.31 50.58,23.39 57.44,16.53 88.56,16.53 102.02,29.99 105.57,29.99 106.72,31.14 106.72,37.1 IC1.2
P1_SPI2_MISO
  Top 0.152: P1_LCD.SD_MISO 53.5,33.47 53.5,30.25 57.82,25.93 IC1.14
P1_SPI2_MOSI
  Top 0.152: P1_LCD.SD_MOSI 51.73,32.71 51.73,31.26 58.46,24.53 59.85,24.53 60.74,25.42 60.74,26.69 59.47,27.96 IC1.15
P1_SPI2_SCK
  Top 0.152: IC1.7 105.19,26.31 104.05,27.45 100.87,27.45 89.06,15.64 52.23,15.64 40.42,27.45 40.42,41.22 P1_LCD.SD_SCK
P1_TRIG_L
  Top 0.152: U$5.B 16.59,46.2 49.06,13.74 90.46,13.74 IC1.27
P1_TRIG_R
  Bottom 0.152: U$6.B 137.95,34.44 134.78,34.44 128.81,28.47 128.81,24.79 123.48,19.45 105.19,19.45 104.05,20.59 104.05,21.99 IC1.28
P1_UART1_RX  (via drill 0.35)
  Top 0.152: IC1.37 66.46,37.99 66.46,57.55 v77.76,68.85
  Bottom 0.152: v77.76,68.85 78.78,69.87 U$11.3
P1_UART1_TX  (via drill 0.35)
  Top 0.152: v66.71,29.48 66.52,29.68 R17.2 71.54,31.01 89.7,49.17 89.7,58.82 U$11.2
  Bottom 0.152: P1_UART.0 57.15,17.31 57.15,20.3 58.71,21.86 59.85,21.86 60.74,22.75 60.74,28.72 61.63,29.61 66.58,29.61 v66.71,29.48
P1_VBUS  (via drill 0.35)
  Top 1.27: v93.38,59.58 93.38,59.33 102.65,50.06 IC1.21
  Bottom 1.27: v93.38,59.58 91.48,59.58 75.86,59.58 70.78,64.66 70.78,73.43 72.17,74.82 U$11.11 U$11.12
P2_3.3V  (via drill 0.35)
  Top 0.152: v275.37,28.85 274.48,29.74 v274.48,35.07 276.01,33.55 v276.9,33.55 | GRAPHICS_TM4C.1 266.74,36.72 259.18,36.72 P2_3.3V.0 225,3.53 191.81,36.72 176.06,36.72 169.2,43.58 169.2,48.15 170.92,49.87 U$13.A1 171.91,49.93 176.06,49.93 182.37,56.24 U$13.A2 182.37,61.7 v184.06,63.39 | v308.65,52.6 308.65,55.9 302.3,62.25 300.52,62.25 298.11,64.66 298.11,66.7 v296.2,68.6 290.61,63.01 U1.1 282.23,64.22 C4.1 | C3.2 274.99,27.33 v274.61,27.71 | P2_LCD.LED 287.62,41.75 282.85,41.75 282.05,40.95 280.65,39.55 280.65,37.85 279.15,36.35 v279.05,36.35
  Bottom 0.152: P2_LCD.LED 288.55,42.69 302.68,42.69 304.84,44.85 304.84,51.2 | U$8.5 U$8.6 v275.37,28.85 | U$8.5 282.19,22.5 | 282.19,22.5 285.91,22.5 287.61,24.2 P2_LCD.VCC | 282.19,22.5 277.72,18.03 R3.2 | C5.2 271.94,38.63 GRAPHICS_TM4C.1 v274.48,35.07 274.48,34.63 C2.2 | 304.84,51.2 R19.1 307.32,51.27 v308.65,52.6 | R18.1 304.46,51.58 304.84,51.2 | R21.1 294.99,68.6 v296.2,68.6 296.2,71.38 R2.1 | v274.61,27.71 274.74,27.58 U$8.5 | v276.9,33.55 | v276.9,33.55 276.9,34.99 U$7.5 277.11,36.45 | R1.1 190.18,69.51 v184.06,63.39 | v279.01,34.03 277.37,34.03 v276.9,33.55 | U$7.6 277.11,36.45 | v279.05,36.35 277.21,36.35 277.11,36.45
P2_BTNA2
  Top 0.152: U$14.A 293.89,41.14 293.89,28.82 289.6,24.53 289.6,18.94 284.26,13.61 266.99,13.61 GRAPHICS_TM4C.29
  Bottom 0.152: U$12.16 247.69,72.28 247.69,74.06 248.7,75.08 277.53,75.08 299.31,53.29 R18.2 299.31,51.01 U$14.A
P2_BTNB2  (via drill 0.35)
  Top 0.152: U$12.17 244,68.35 243.11,67.46 232.19,67.46 v231.94,67.71 | v231.94,64.79 232.07,64.66 v232.07,47.26
  Bottom 0.152: U$12.17 245.27,72.41 245.27,74.19 246.67,75.59 277.85,75.59 300.27,53.17 R19.2 305.66,54 U$15.A | GRAPHICS_TM4C.35 225.21,22.63 232.07,29.48 v232.07,47.26 | v231.94,67.71 v231.94,64.79
P2_BTNL2  (via drill 0.35)
  Top 0.152: v235.11,69.36 237.15,69.36 U$12.19 | v233.97,47.52 v233.97,64.79
  Bottom 0.152: U$4.A 193,74.01 195.62,71.39 195.62,71.4 R1.2 232.94,71.41 234.99,69.36 | 234.99,69.36 v235.11,69.36 | GRAPHICS_TM4C.34 233.84,28.47 233.84,47.39 v233.97,47.52 | v233.97,64.79 233.97,68.35 234.99,69.36
P2_BTNR2  (via drill 0.35)
  Top 0.152: v236.38,64.79 236.38,57.75 235.17,56.53 235.17,45.41 v235.11,45.36
  Bottom 0.152: U$3.A 306.67,75.64 298.55,75.64 R2.2 298.04,75.25 297.16,76.14 234.15,76.14 233.46,75.46 233.46,74.06 U$12.20 v236.38,64.79 | GRAPHICS_TM4C.33 235.11,27.2 v235.11,45.36
P2_BTNSTART2  (via drill 0.35)
  Top 0.152: v279.69,75.08 261.22,75.08 260.1,76.2 242.2,76.2 240.19,74.19 240.19,72.41 U$12.18 | GRAPHICS_TM4C.31 223.43,10.43 220.64,10.43 208.06,23.01 208.06,37.36 207.3,38.12 206.03,38.12 204.51,39.64 204.51,45.49 222.67,63.65 v224.45,63.65
  Bottom 0.152: U$17.A 292.2,67.39 R21.2 292.2,69.9 293.25,70.95 295.05,70.95 296.55,72.45 296.55,75.15 296.05,75.65 280.27,75.65 v279.69,75.08 | v224.45,63.65 240.07,63.65 241.46,65.04 U$12.18
P2_GND  (via drill 0.35)
  Top 0.152: LED3.C 270.07,9.83 v271.31,11.07 | C4.2 278.55,66 v278.55,66.95 | C3.1 278.61,24.22 v279.56,23.26 | U$13.C1 171.85,44.58 v171.74,44.47 | U$13.C2 187.41,60.04 v187.62,59.84 | v275.95,41.95 275.85,41.85 | 264.55,43.45 v264.65,43.35 | v241.55,41.25 241.15,40.85 | 237.25,31.95 v237.35,31.85
  Top 0.508: U$12.7 245.4,75.08 250.23,75.08 U$12.4
  Top 1.27: v284.26,27.83 285.36,26.74 P2_LCD.GND 289.9,26.74 v292.52,29.36 | v234.86,74.82 v232.07,74.82 | 275.85,41.85 v273.65,41.85
  Top 2.54: v281.34,25.04 v279.56,23.26 | v260.13,51.07 v260.13,54.5 | v285.91,17.55 v282.87,20.59 | v260.26,62.76 v260.26,60.47 | v303.57,46.22 v306.11,46.22 | v294,53.05 v291.65,53.05 | v254.2,24.65 v260.5,30.95 | v216.3,46.6 v216.3,49.85 | v247.65,58.45 v249.25,60.05 | v260.85,43.45 264.55,43.45 | 241.15,40.85 v238.95,40.85 | v230.75,36.65 v237.05,36.65 | v230.75,34.45 v237.15,34.45 | v230.75,31.95 237.25,31.95 | v233.75,15.25 234.65,16.15 v236.15,16.15 | v246.35,42.85 v248.65,42.85
  Bottom 0.152: P2_LCD.GND 285.41,24.3 v285.41,24.02 | v237.05,36.65 236.82,36.89 236.82,46.95 236.84,46.97 236.84,47.56 236.17,48.23 232.03,48.23 231.36,47.56 231.36,35.06 v230.75,34.45
  pour Bottom: 183.3,84.48 163.99,65.17 163.99,2.56 170.09,-3.54 293.41,-3.54 300.33,3.39 308.65,-4.81 325.92,-4.81 332.27,1.54 332.27,63.65 311.44,84.48
P2_JS2_H  (via drill 0.35)
  Top 0.152: U$12.14 251.62,67.2 253.52,65.31 v253.52,50.86 | v177.07,48.03 177.03,48.07 U$13.B1
  Bottom 0.152: v253.52,50.86 251.32,48.66 251.12,48.66 | v177.07,48.03 177.71,48.66 251.12,48.66 | GRAPHICS_TM4C.27 247.56,38.12 247.56,45.11 251.12,48.66
P2_JS2_V  (via drill 0.35)
  Top 0.152: U$12.15 249.46,70.76 v249.46,69.36 | v247.43,67.2 247.18,66.95 225.33,66.95 | GRAPHICS_TM4C.28 264.84,18.3 v262.93,18.3 | v237.53,42.69 231.3,42.69 226.99,47.01 226.99,65.3 225.33,66.95 | U$13.B2 184.17,61.09 190.03,66.95 225.33,66.95
  Bottom 0.152: v249.46,69.36 247.43,67.33 v247.43,67.2 | v262.93,18.3 262.93,18.4 238.64,42.69 v237.53,42.69
P2_LCD_DC  (via drill 0.35)
  Top 0.152: v282.99,23.52 279.56,20.09 277.4,20.09 272.07,14.75 GRAPHICS_TM4C.9
  Bottom 0.152: U1.7 283.73,46.28 283.73,37.64 286.68,34.69 286.68,32.95 | 286.68,32.95 286.68,28.47 282.99,24.79 v282.99,23.52 | P2_LCD.DC 287.84,34.12 286.68,32.95
P2_LCD_DC_BUF  (via drill 0.35)
  Top 0.152: U$12.8 243.52,75.74 259.98,75.74 273.98,61.74 275.12,61.74 276.01,60.85 276.01,59.46 281.34,54.12 282.99,54.12 285.25,51.86 v285.25,49.25
  Bottom 0.152: R27.2 284.67,45.66 284.67,48.67 v285.25,49.25
P2_LCD_RESET  (via drill 0.35)
  Top 0.152: GRAPHICS_TM4C.6 272.58,26.56 272.58,36.47 276.41,40.3 278.8,40.3 280.41,41.91 280.05,42.26 v280.05,51.35 | v284.55,25.05 282.15,27.45 280.65,27.45 v278.35,25.15
  Bottom 0.152: P2_LCD.RESET 288.65,31 288.65,30.31 289.35,29.61 289.35,28.75 288.55,27.95 287.45,27.95 v284.55,25.05 | v278.35,25.15 275.57,22.37 GRAPHICS_TM4C.6 | v280.05,51.35 281.55,52.85 U1.5
P2_LCD_RESET_BUF  (via drill 0.35)
  Top 0.152: U1.4 280.96,55.39 276.64,59.71 276.64,62.89 275.54,63.99 273.12,63.99 v267.37,69.74 | v242.86,68.6 241.97,68.6 240.19,70.38 240.19,71.78 238.92,73.05 U$12.9
  Bottom 0.152: v267.37,69.74 255.43,69.74 250.23,64.54 246.92,64.54 v242.86,68.6
P2_SPI0_CS  (via drill 0.35)
  Top 0.152: v256.51,54.49 255.77,53.75 255.77,41.76 230.07,16.05 223.97,16.05 GRAPHICS_TM4C.12 | P2_LCD.CS 287.84,30.04 292.76,34.96 292.76,45.72 292.75,45.73 292.75,46.35 289.55,49.55 289.55,55.15 288.75,55.95 284.21,55.95 U1.3
  Bottom 0.152: U1.3 278.42,54.12 273.21,54.12 272.32,53.23 257.77,53.23 v256.51,54.49
P2_SPI0_CS_BUF  (via drill 0.35)
  Top 0.152: v246.16,63.52 240.83,63.52 v239.56,64.79 | R20.2 290.1,60.85 v290.74,60.22 | v290.35,41.55 290.35,44.34 v291.25,45.23
  Bottom 0.152: P2_SPI0_CS_BUF.0 246.11,8.66 273.85,8.66 290.35,25.16 v290.35,41.55 | U$12.10 237.53,72.54 237.53,66.82 v239.56,64.79 | v291.25,45.23 291.25,45.61 292.77,47.14 292.77,58.82 291.37,60.22 v290.74,60.22 290.74,61.11 282.36,69.49 268.64,69.49 267.63,68.47 255.43,68.47 250.48,63.52 v246.16,63.52
P2_SPI0_MOSI  (via drill 0.35)
  Top 0.152: v274.23,20.72 273.59,21.36 v273.59,36.34 275.74,36.34 277.63,34.45 277.63,33.23 277.25,32.85 277.25,32.45 277.79,31.92 278.72,31.92 279.25,32.45 279.25,33.15 280.35,34.25 283.05,34.25 284.15,33.15 v289.35,33.15
  Bottom 0.152: v274.23,20.72 270.8,17.29 GRAPHICS_TM4C.8 | v273.59,36.34 274.59,37.33 274.59,45.21 U1.9 | v289.35,33.15 289.35,35.38 P2_LCD.MOSI
P2_SPI0_MOSI_BUF  (via drill 0.35)
  Top 0.152: v248.58,65.43 251.5,62.5 v251.5,47.52 | v268.51,48.92 269.66,47.77 R29.2 269.85,47.2 273.85,43.2 v279.31,43.2 | v282.1,42.31 284.29,42.31 284.36,42.25 286.04,42.25 v286.25,42.46 | v291.85,43.75 v291.85,41.45
  Bottom 0.152: P2_SPI0_MOSI_BUF.0 250.23,7.77 273.59,7.77 290.85,25.02 290.85,38.42 290.85,38.43 290.85,40.45 v291.85,41.45 | U$12.5 249.08,73.05 247.81,71.78 247.81,69.24 246.04,67.46 246.04,66.31 246.92,65.43 v248.58,65.43 | v251.5,47.52 255.94,51.96 265.47,51.96 v268.51,48.92 | v279.31,43.2 281.21,43.2 v282.1,42.31 | v286.25,42.46 286.79,42.46 287.43,43.1 291.2,43.1 v291.85,43.75
P2_SPI0_SCK  (via drill 0.35)
  Top 0.152: GRAPHICS_TM4C.11 223.94,13.48 228.45,13.48 265.28,50.31 U1.11 275.2,50.31 v277.75,47.75 | P2_LCD.SCK 283.97,39.44 v282.75,40.65
  Bottom 0.152: v277.75,47.75 277.75,47.45 281.95,43.25 282.65,43.25 283.25,42.65 283.25,41.15 v282.75,40.65
P2_SPI0_SCK_BUF  (via drill 0.35)
  Top 0.152: v267.5,51.58 267.75,51.84 269.85,51.84 | 269.85,51.84 R28.2 | v291.85,39.85 290.85,39.85 289.35,41.35 289.35,42.75 288.85,43.25 284.95,43.25 v284.65,42.95 283.65,43.95 281.45,43.95 280.46,44.95 280.46,50.56 281.15,51.25 281.15,51.95 278.85,54.25 272.27,54.25 269.85,51.84
  Bottom 0.152: P2_SPI0_SCK_BUF.0 254.34,6.88 273.34,6.88 291.25,24.79 291.25,38.25 291.26,38.26 291.26,39.26 v291.85,39.85 | v267.5,51.58 266.48,52.6 255.05,52.6 241.97,65.68 241.97,68.98 242.48,69.49 244.26,69.49 245.27,70.51 245.27,71.78 246.54,73.05 U$12.6
P2_SPI2_CS
  Top 0.152: GRAPHICS_TM4C.2 270.04,34.18 270.04,36.72 265.34,41.42 257.21,41.42 225.72,9.93 219.87,9.93 206.66,23.14 P2_LCD.SD_CS
P2_SPI2_MISO
  Bottom 0.152: P2_LCD.SD_MISO 208.7,39.95 208.7,31.52 220.38,19.83 GRAPHICS_TM4C.14
P2_SPI2_MOSI
  Top 0.152: P2_LCD.SD_MOSI 207.68,39.44 210.6,36.52 210.6,33.93 222.16,22.37 GRAPHICS_TM4C.15
P2_SPI2_SCK  (via drill 0.35)
  Top 0.152: P2_LCD.SD_SCK 211.97,39.22 249.67,39.22 v250.1,39.64 | v263.56,23.9 266.1,23.9 267.12,22.88 267.12,21.1 GRAPHICS_TM4C.7
  Bottom 0.152: v250.1,39.64 263.56,26.18 v263.56,23.9
P2_SPI3_CS
  Top 0.152: P2_SPI3_CS.0 255,16.61 GRAPHICS_TM4C.24
  Bottom 0.152: U$7.1 281,40.03 276.39,40.03 275.25,38.88 275.25,33.29 270.55,28.6 266.99,28.6 GRAPHICS_TM4C.24
P2_SPI3_MISO  (via drill 0.35)
  Top 0.152: P2_SPI3_MISO.0 261.78,10.77 v261.78,16.15
  Bottom 0.152: v261.78,16.15 264.2,18.56 266.1,18.56 267.12,19.58 267.12,23.64 GRAPHICS_TM4C.25 266.99,26.06 270.29,26.06 274.48,30.25 275.25,30.25 276.01,29.48 281.38,29.48 U$8.2 282.92,30.12 283.65,30.85 283.65,31.65 283.15,32.15 282.25,32.15 280.45,33.95 280.45,37.05 281.14,37.74 U$7.2
P2_SPI3_MOSI
  Top 0.152: P2_SPI3_MOSI.0 260,16.53 GRAPHICS_TM4C.26
  Bottom 0.152: U$7.8 276.98,38.88 276.52,38.88 275.75,38.12 275.75,32.74 U$8.8 274.99,31.39 270.06,26.46 266.01,26.46 264.58,25.04 264.58,23.39 265.59,22.37 GRAPHICS_TM4C.26
P2_SPI3_SCK  (via drill 0.35)
  Top 0.152: GRAPHICS_TM4C.23 266.1,29.99 267.63,28.47 269.66,28.47 271.82,30.63 271.82,36.28 276.7,41.17 v278.29,41.17 | v278.29,32.79 278.04,33.04 278.04,36.6 v278.93,37.49 278.55,37.87 278.55,39.14 280.45,41.04 v280.71,41.04 | v292.26,31.18 290.4,31.18 v289.6,30.37 289.6,29.1 288.45,27.96 286.04,27.96 282.1,31.9 281.34,31.9 v280.33,32.91
  Bottom 0.152: v278.29,41.17 280.58,41.17 v280.71,41.04 | U$8.7 277.91,30.12 278.55,30.75 278.55,32.53 v278.29,32.79 | U$7.7 277.36,37.49 v278.93,37.49 279.82,38.37 v279.82,38.88 279.82,36.6 280,36.42 280,33.24 v280.33,32.91 | P2_SPI3_SCK_BUF.0 268.57,6.12 273.21,6.12 291.67,24.58 291.67,30.6 v292.26,31.18
P2_UART1_RX  (via drill 0.35)
  Top 0.152: v249.85,66.19 252.64,63.39 252.64,40.41 239.69,27.45 GRAPHICS_TM4C.37
  Bottom 0.152: R30.1 226.03,27.45 GRAPHICS_TM4C.37 | U$12.2 255.56,72.54 253.78,72.54 252.89,71.65 252.89,70.25 249.85,67.2 v249.85,66.19
P2_UART1_TX  (via drill 0.35)
  Top 0.152: v236.13,23.9 232.13,23.9 R4.2 | U$12.3 254.16,73.43 253.15,72.41 250.86,72.41 250.35,71.9 250.35,68.6 247.18,65.43 247.18,61.62 236.13,50.57 v236.13,47.26
  Bottom 0.152: P2_UART1_TX.0 235.11,2.66 235.11,22.88 v236.13,23.9 v236.13,47.26
P2_VBUS  (via drill 0.35)
  Top 1.27: v262.8,50.69 262.8,70.38 262.04,71.14 U$12.11 U$12.12
  Bottom 1.27: v262.8,50.69 262.8,38.25 265.85,35.2 GRAPHICS_TM4C.21

### Text on the board
tPlace: START | START | A | A | B | B | EE319H / Spring 2020 | Allen Jiang / Jason Math | EE319H / Spring 2020 | Allen Jiang / Jason Math | SPI0 | SPI3 | 3.3V | GND | UART | AUDIO | 3.3V | GND | UART | CS | MOSI | SCK | CS | MOSI | SCK | MISO
bPlace: Good Morning Gamers | Good Morning Gamers | JLCJLCJLCJLC